# Altium schematic sheet power_supply.SchDoc
size A4; SheetNumber: 4; SheetTotal: 5
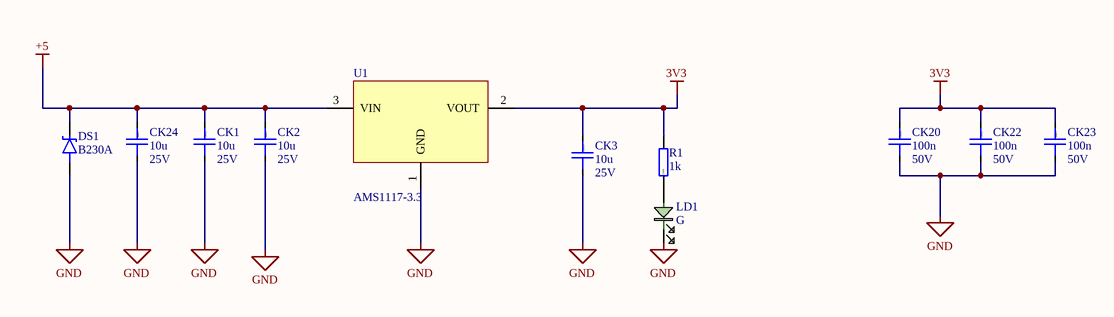
[diagram p0: power_supply.SchDoc]

## Parts
CK1  10u  Voltage rating: 25V  [CAP0805]
CK2  10u  Voltage rating: 25V  [CAP0805]
CK3  10u  Voltage rating: 25V  [CAP0805]
CK20  100n  Voltage rating: 50V  [CAP0603]
CK22  100n  Voltage rating: 50V  [CAP0603]
CK23  100n  Voltage rating: 50V  [CAP0603]
CK24  10u  Voltage rating: 25V  [CAP0805]
DS1  B230A  [DIOM4326X23M]
LD1  G  [0603_LED_G]
R1  1k  [RESC2012X06N(SMR0805)]
U1  AMS1117-3.3  [SOT230P700X180-4M]

## Nets
3V3: CK3.1 CK20.1 CK22.1 CK23.1 R1.1 U1.2(VOUT)
+5: CK1.1 CK2.1 CK24.1 DS1.1 U1.3(VIN)
GND: CK1.2 CK2.2 CK3.2 CK20.2 CK22.2 CK23.2 CK24.2 DS1.2 LD1.2 U1.1(GND)
NetLD1_1: LD1.1 R1.2

## Notes on the sheet
- (in symbol Cap 10u 0805) 0805
- (in symbol Cap 100n 0603) 0603

## Library data of the parts
CK1-CK3 CK24 = Cap 10u 0805: 25V 10uF X5R ±10% 0805 Multilayer Ceramic Capacitors MLCC - SMD/SMT ROHS; Basic: Yes; JLCPCB Part: C15850; Value: 10u
CK20 CK22 CK23 = Cap 100n 0603: 50V 100nF X7R ±10% 0603 Multilayer Ceramic Capacitors MLCC - SMD/SMT ROHS; Basic: Yes; Value: 100n; JLCPCB Part: C14663
DS1 = B230A-13-F: 30V 500mV@2A 2A SMA(DO-214AC) Schottky Diodes ROHS; JLCPCB Part: C12889
LD1 = LED G 0603: 0603 Green Led; JLCPCB Part: C22371297
R1 = Res 1k 0805: 125mW Thick Film Resistors 150V ±100ppm/℃ ±1% 1kΩ 0805 Chip Resistor - Surface Mount ROHS; Tolerance & Rating: 1%/0.1W; Basic: Yes; Value: 1k; Package: 0805; Author: JP/27.03.2014; SMD: 1; ComponentLink3Description: rezistor čip; ComponentLink3URL: heliosgreen://v1/hegMT/5-MT/Classes(343)/Folders/OpenForm?RecordNumbers=[381513]; JLCPCB Part: C17513
U1 = AMS1117-3.3: 72dB@(120Hz) 1A Fixed 3.3V Positive electrode SOT-223 Voltage Regulators - Linear, Low Drop Out (LDO) Regulators ROHS; Basic: Yes; JLCPCB Part: C6186